# EAGLE schematic h_sim (EAGLE 9.2.0)
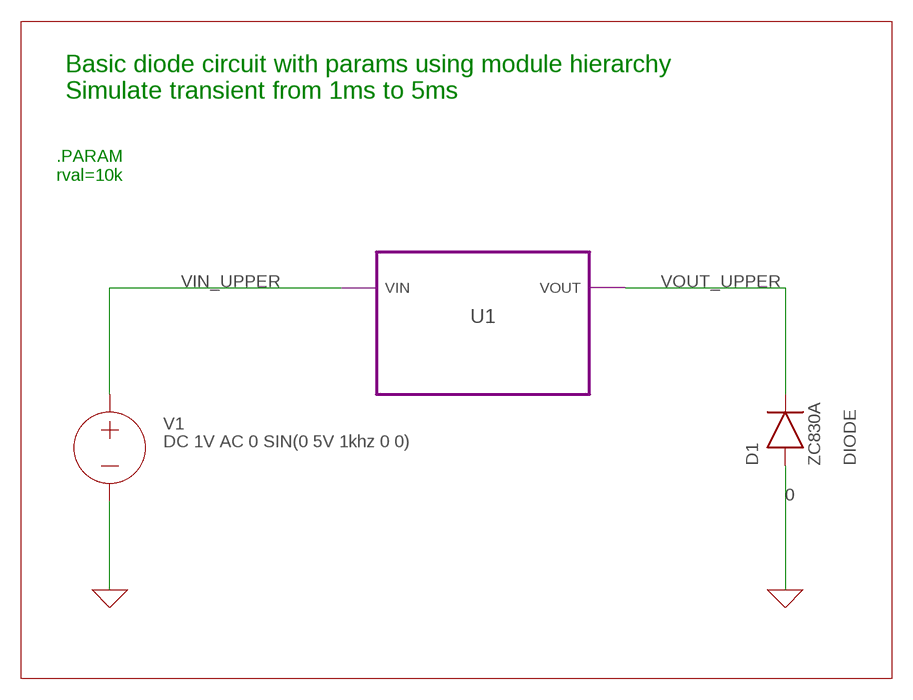
[diagram p0: schematic, sheet 1]

## Parts
D1  DIODE  (no package)
V1  DC 1V AC 0 SIN(0 5V 1khz 0 0)  VOLTAGE  (no package)

## Module instances
U1 = DIODECKT

## Nets
0: D1.A V1.- ; supply symbol labelled GND
VIN_UPPER: V1.+ ; port U1.VIN
VOUT_UPPER: D1.C ; port U1.VOUT

## Notes on the sheet
- Basic diode circuit with params using module hierarchy
  Simulate transient from 1ms to 5ms
- .PARAM
  rval=10k

## Library data of the parts
D1 = ngspice-simulation:DIODE: Diode; SPICEMODEL: ZC830A; SPICEPREFIX: D
V1 = ngspice-simulation:VOLTAGE: Independent Voltage Source, either DC, AC, PULSE, SINE, PWL, EXP, or SFFM; VALUE: 0V

## Module DIODECKT
Ports: VIN(io) VOUT(io)
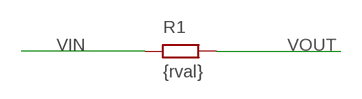
[diagram p1: schematic, module DIODECKT, sheet 1]

### Parts
R1  {rval}  R  (no package)

### Nets
VIN: R1.1
VOUT: R1.2

### Library data of the parts
R1 = ngspice-simulation:R: RESISTOR